# EAGLE design Omnibot_battery_module (EAGLE 9.4.2)
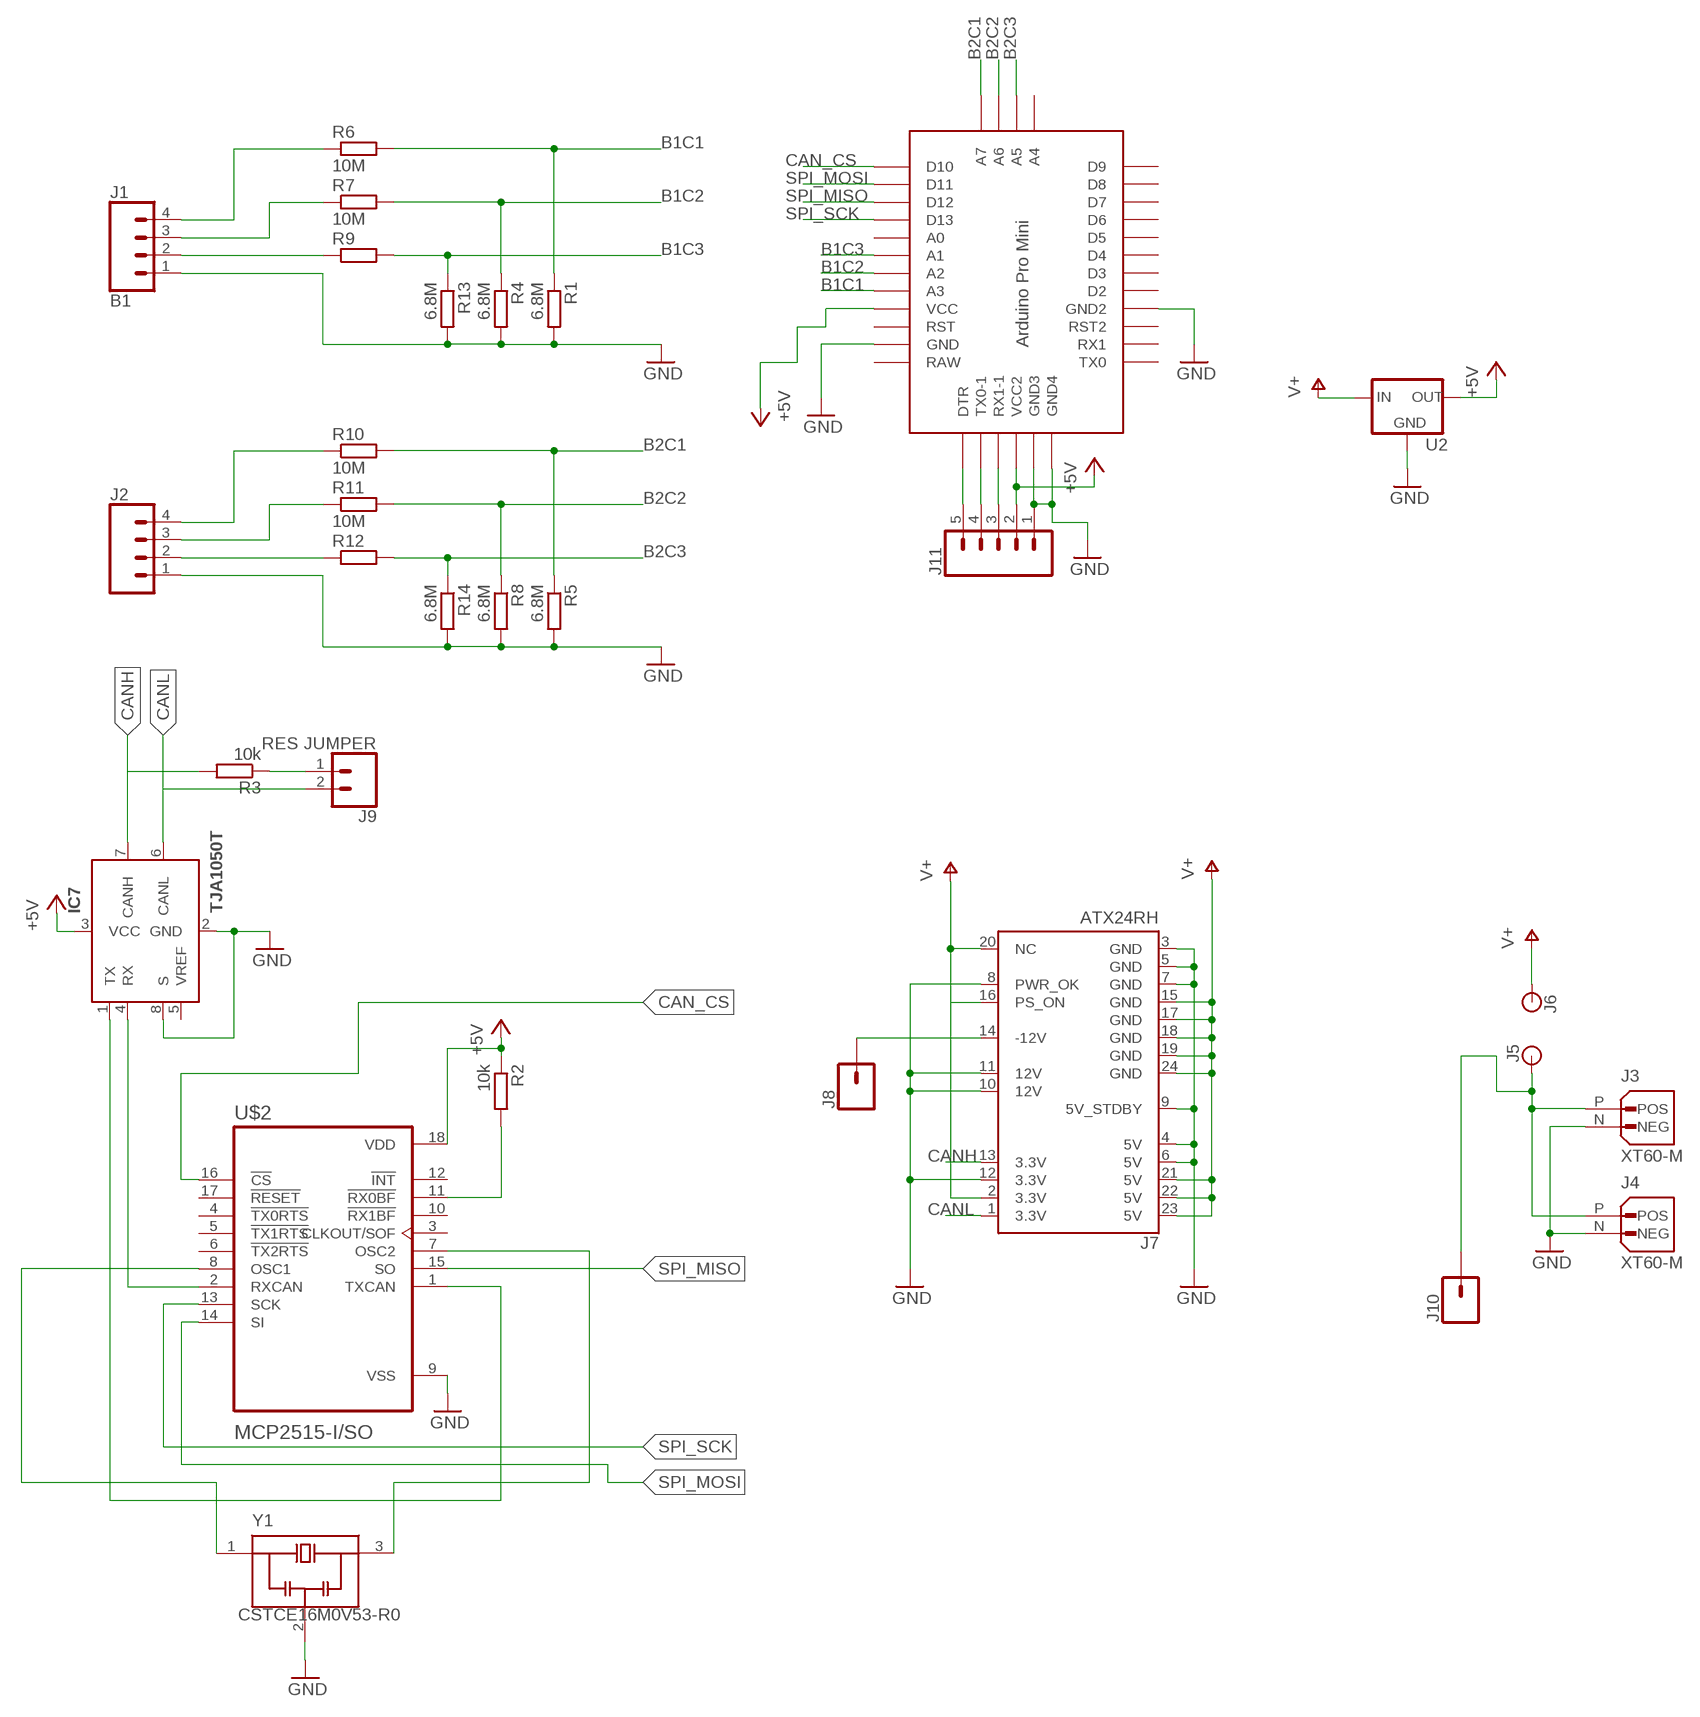
[diagram p0: schematic, sheet 1]

## Parts
IC7  TJA1050T  [SOIC8]
J1  B1  CONN_04POLAR  [MOLEX-1X4]
J2  CONN_04POLAR  [MOLEX-1X4]
J3  XT60-M  [AMASS_XT60-M]
J4  XT60-M  [AMASS_XT60-M]
J5  BANANA_CONN  [BANANA_CONN]
J6  BANANA_CONN  [BANANA_CONN]
J7  ATX24RH  [ATX24_RIGHT_ANGLE]
J8  CONN_01  [1X01]
J9  RES JUMPER  CONN_02  [1X02]
J10  CONN_01  [1X01]
J11  CONN_05PTH  [1X05]
R1  6.8M  R-EU_M0805  [M0805]
R2  10k  R-EU_R0805  [R0805]
R3  10k  R-EU_R0805  [R0805]
R4  6.8M  R-EU_M0805  [M0805]
R5  6.8M  R-EU_M0805  [M0805]
R6  10M  R-EU_M0805  [M0805]
R7  10M  R-EU_M0805  [M0805]
R8  6.8M  R-EU_M0805  [M0805]
R9  10M  R-EU_M0805  [M0805]
R10  10M  R-EU_M0805  [M0805]
R11  10M  R-EU_M0805  [M0805]
R12  10M  R-EU_M0805  [M0805]
R13  6.8M  R-EU_M0805  [M0805]
R14  6.8M  R-EU_M0805  [M0805]
U2  V_REG_78XX-TO-220  [TO-220-ALT]
U$1  PRO-MINI  [PRO-MINI]
U$2  MCP2515-I/SO  [SOIC127P1030X265-18N]
Y1  CSTCE16M0V53-R0  [OSC_CSTCE16M0V53-R0]

## Nets
+5V: IC7.3(VCC) J11.2 R2.1 U2.OUT U$1.VCC U$1.VCC1(VCC2) U$2.18(VDD)
B1C1: R1.1 R6.2 U$1.A3
B1C2: R4.1 R7.2 U$1.A2
B1C3: R9.2 R13.1 U$1.A1
B2C1: R5.1 R10.2 U$1.A7
B2C2: R8.1 R11.2 U$1.A6
B2C3: R12.2 R14.1 U$1.A5
CAN_CS: U$1.D10 U$2.16(!CS)
CANH: IC7.7(CANH) J7.13(3.3V) R3.2
CANL: IC7.6(CANL) J7.1(3.3V) J9.2
GND: IC7.2(GND) IC7.8(S) J1.1 J2.1 J3.N(NEG) J4.N(NEG) J7.3(GND) J7.4(5V) J7.5(GND) J7.6(5V) J7.7(GND) J7.8(PWR_OK) J7.9(5V_STDBY) J7.10(12V) J7.11(12V) J7.12(3.3V) J11.1 R1.2 R4.2 R5.2 R8.2 R13.2 R14.2 U2.GND U$1.GND U$1.GND1(GND2) U$1.GND2(GND4) U$1.GND3 U$2.9(VSS) Y1.2(GND)
N$1: J7.14(-12V) J8.1
N$3: U$2.8(OSC1) Y1.1(IN)
N$4: J3.P(POS) J4.P(POS) J5.P$1 J10.1
N$5: IC7.4(RX) U$2.2(RXCAN)
N$6: R2.2 U$2.11(!RX0BF)
N$7: IC7.1(TX) U$2.1(TXCAN)
N$9: U$2.7(OSC2) Y1.3(OUT)
N$11: J1.4 R6.1
N$12: J9.1 R3.1
N$13: J1.3 R7.1
N$17: J1.2 R9.1
N$19: J2.4 R10.1
N$20: J2.3 R11.1
N$22: J2.2 R12.1
N$24: J11.3 U$1.RX1-1
N$25: J11.4 U$1.TX0-1
N$26: J11.5 U$1.DTR
SPI_MISO: U$1.D12 U$2.15(SO)
SPI_MOSI: U$1.D11 U$2.14(SI)
SPI_SCK: U$1.D13 U$2.13(SCK)
V+: J6.P$1 J7.2(3.3V) J7.15(GND) J7.16(PS_ON) J7.17(GND) J7.18(GND) J7.19(GND) J7.20(NC) J7.21(5V) J7.22(5V) J7.23(5V) J7.24(GND) U2.IN
Unconnected: IC7.5(VREF) U$1.A0 U$1.A4 U$1.D2 U$1.D3 U$1.D4 U$1.D5 U$1.D6 U$1.D7 U$1.D8 U$1.D9 U$1.RST U$1.RST1(RST2) U$1.RX1 U$1.TX0 U$2.3(CLKOUT/SOF) U$2.4(!TX0RTS) U$2.5(!TX1RTS) U$2.6(!TX2RTS) U$2.10(!RX1BF) U$2.12(!INT) U$2.17(!RESET)

## Power pins joined to a net without a drawn wire
RAW: U$1.RAW

## Library data of the parts
IC7 = TJA1050:TJA1050; MF: NXP; MPN: TJA1050T
J1 J2 = SparkFun-Connectors:CONN_04: Multi connection point. Often used as Generic Header-pin footprint for 0.1 inch spaced/style header connections On any of the 0.1 inch spaced packages, you can populate with these: Break Away Headers - Straight <https://www.sparkfun.com/products/116> (PRT-00116) Break Away Male Headers - Right Angle <https://www.sparkfun.com/products/553> (PRT-00553) Female Headers <https://www.sparkfun.com/products/115> (PRT-00115) Break Away Headers - Machine Pin <https://www.sparkfun.com/products/117> (PRT-00117) Break Away Female Headers - Swiss Machine Pin <https://www.sparkfun.com/products/743> (PRT-00743) For SCREWTERMINALS and SPRING TERMINALS visit here: Screw Terimnals on SparkFun.com <https://www.sparkfun.com/search/results?term=Screw+Terminals> (5mm/3.5mm/2.54mm spacing) This device is also useful as a general connection point to wire up your design to another part of your project. Our various solder wires solder well into these plated through hole pads. Hook-Up Wire - Assortment (Stranded, 22 AWG) <https://www.sparkfun.com/products/11375> (PRT-11375) Hook-Up Wire - Assortment (Solid Core, 22 AWG) <https://www.sparkfun.com/products/11367> (PRT-11367) View the entire wire category on our website here <https://www.sparkfun.com/categories/141> Special notes: Molex polarized connector foot print use with SKU : PRT-08231 with associated crimp pins and housings. 1MM SMD Version SKU: PRT-10208; PROD_ID: CONN-08186; SF_ID: PRT-08231
J3 J4 = XT60-M:XT60-M: Check availability <https://pricing.snapeda.com/parts/XT60-M/AMASS/view-part?ref=eda>; AVAILABILITY: Not in stock; CHECK_PRICES: https://www.snapeda.com/parts/XT60-M/AMASS/view-part/?ref=eda; DESCRIPTION: Plug; DC supply; XT60; male; PIN: 2; for cable; soldered; 30A; 500V; MF: AMASS; MP: XT60-M; PACKAGE: Package; PRICE: None; SNAPEDA_LINK: https://www.snapeda.com/parts/XT60-M/AMASS/view-part/?ref=snap
J5 J6 = SparkFun-Connectors:BANANA_CONN: Through-hole Banana Jack Basic PTH connection for banana jack plugs SparkFun Products: Multimeter Kit <https://www.sparkfun.com/products/retired/10956> Banana to Alligator Cable <https://www.sparkfun.com/products/retired/509> Banana to Alligator Coax Cable <https://www.sparkfun.com/products/retired/508> Banana to Banana Cable <https://www.sparkfun.com/products/retired/507> Banana to IC Hook Cables <https://www.sparkfun.com/products/retired/506>
J7 = SparkFun-Connectors:ATX24: ATX24 Pin Power Supply Connector - Right Angle PTH Mount This is a good connector for connecting a computer power supply to a PCB. It's massive, but provides many amps of power at 5V and 12V. SparkFun Products: SparkFun Benchtop Power Board Kit <https://www.sparkfun.com/products/12867> SparkFun Power Driver Shield Kit <https://www.sparkfun.com/products/10618>; PROD_ID: CONN-09674; SF_ID: PRT-09498
J8 J10 = SparkFun-Connectors:CONN_01: Single connection point. Often used as Generic Header-pin footprint for 0.1 inch spaced/style header connections On any of the 0.1 inch spaced packages, you can populate with these: Break Away Headers - Straight <https://www.sparkfun.com/products/116> (PRT-00116) Break Away Male Headers - Right Angle <https://www.sparkfun.com/products/553> (PRT-00553) Female Headers <https://www.sparkfun.com/products/115> (PRT-00115) Break Away Headers - Machine Pin <https://www.sparkfun.com/products/117> (PRT-00117) Break Away Female Headers - Swiss Machine Pin <https://www.sparkfun.com/products/743> (PRT-00743) This device is also useful as a general connection point to wire up your design to another part of your project. Our various solder wires solder well into these plated through hole pads. Hook-Up Wire - Assortment (Stranded, 22 AWG) <https://www.sparkfun.com/products/11375> (PRT-11375) Hook-Up Wire - Assortment (Solid Core, 22 AWG) <https://www.sparkfun.com/products/11367> (PRT-11367) View the entire wire category on our website here <https://www.sparkfun.com/categories/141> Special notes: SMTSO-256-ET is a "flush mount" nut for a 4-40 screw. We mostly use this on specialty testbeds; it is a nice way to connect hardware to your PCB at an adjustable hieght. Also note, the SNAP packages are for using a snappable style connector. We sell a baggie of snaps and they are also used on two LilyPad designs: Snap Assortment - 30 pack (male and female) <https://www.sparkfun.com/products/11347> (DEV-11347) LilyPad Arduino SimpleSnap <https://www.sparkfun.com/products/10941> (DEV-10941) LilyPad SimpleSnap Protoboard <https://www.sparkfun.com/products/10940> (DEV-10940)
J9 = SparkFun-Connectors:CONN_02: Multi connection point. Often used as Generic Header-pin footprint for 0.1 inch spaced/style header connections On any of the 0.1 inch spaced packages, you can populate with these: Break Away Headers - Straight <https://www.sparkfun.com/products/116> (PRT-00116) Break Away Male Headers - Right Angle <https://www.sparkfun.com/products/553> (PRT-00553) Female Headers <https://www.sparkfun.com/products/115> (PRT-00115) Break Away Headers - Machine Pin <https://www.sparkfun.com/products/117> (PRT-00117) Break Away Female Headers - Swiss Machine Pin <https://www.sparkfun.com/products/743> (PRT-00743) For SCREWTERMINALS and SPRING TERMINALS visit here: Screw Terimnals on SparkFun.com <https://www.sparkfun.com/search/results?term=Screw+Terminals> (5mm/3.5mm/2.54mm spacing) This device is also useful as a general connection point to wire up your design to another part of your project. Our various solder wires solder well into these plated through hole pads. Hook-Up Wire - Assortment (Stranded, 22 AWG) <https://www.sparkfun.com/products/11375> (PRT-11375) Hook-Up Wire - Assortment (Solid Core, 22 AWG) <https://www.sparkfun.com/products/11367> (PRT-11367) View the entire wire category on our website here <https://www.sparkfun.com/categories/141> Special notes: Molex polarized connector foot print use with: PRT-08233 with associated crimp pins and housings. 2.54_SCREWTERM for use with PRT-10571. 3.5mm Screw Terminal footprints for PRT-08084 5mm Screw Terminal footprints for use with PRT-08432
J11 = SparkFun-Connectors:CONN_05: Multi connection point. Often used as Generic Header-pin footprint for 0.1 inch spaced/style header connections On any of the 0.1 inch spaced packages, you can populate with these: Break Away Headers - Straight <https://www.sparkfun.com/products/116> (PRT-00116) Break Away Male Headers - Right Angle <https://www.sparkfun.com/products/553> (PRT-00553) Female Headers <https://www.sparkfun.com/products/115> (PRT-00115) Break Away Headers - Machine Pin <https://www.sparkfun.com/products/117> (PRT-00117) Break Away Female Headers - Swiss Machine Pin <https://www.sparkfun.com/products/743> (PRT-00743) For SCREWTERMINALS and SPRING TERMINALS visit here: Screw Terimnals on SparkFun.com <https://www.sparkfun.com/search/results?term=Screw+Terminals> (5mm/3.5mm/2.54mm spacing) This device is also useful as a general connection point to wire up your design to another part of your project. Our various solder wires solder well into these plated through hole pads. Hook-Up Wire - Assortment (Stranded, 22 AWG) <https://www.sparkfun.com/products/11375> (PRT-11375) Hook-Up Wire - Assortment (Solid Core, 22 AWG) <https://www.sparkfun.com/products/11367> (PRT-11367) View the entire wire category on our website here <https://www.sparkfun.com/categories/141> Special notes: Molex polarized connector foot print use with SKU : PRT-08231 with associated crimp pins and housings. 1MM SMD Version SKU: PRT-10208
R1-R14 = resistor:R-EU_: RESISTOR, European symbol
U2 = SparkFun-IC-Power:V_REG_78XX: Voltage Regulator Standard 78xx regulator. IGO (Input Ground Output). Spark Fun Electronics SKU : COM-00107; PROD_ID: VREG-08450; SF_ID: COM-00107
U$1 = Arduino-clone:PRO-MINI: Arduion Pro Mini Clone V1.0 www.betemcu.cu
U$2 = MCP2515-I_SO:MCP2515-I/SO: Check availability <https://pricing.snapeda.com/parts/MCP2515-I/SO/Microchip/view-part?ref=eda>; AVAILABILITY: In Stock; CHECK_PRICES: https://www.snapeda.com/parts/MCP2515-I/SO/Microchip/view-part/?ref=eda; DESCRIPTION: Microchip CAN Controller 1Mbit/s CAN 2.0B 18-Pin SOIC W | Microchip Technology Inc. MCP2515-I/SO; MF: Microchip; MP: MCP2515-I/SO; PACKAGE: SOIC-18 Microchip; PRICE: None; PURCHASE-URL: https://www.snapeda.com/api/url_track_click_mouser/?unipart_id=39881&manufacturer=Microchip&part_name=MCP2515-I/SO&search_term=None; SNAPEDA_LINK: https://www.snapeda.com/parts/MCP2515-I/SO/Microchip/view-part/?ref=snap
Y1 = CSTCE16M0V53-R0:CSTCE16M0V53-R0: Check availability <https://pricing.snapeda.com/parts/CSTCE16M0V53-R0/Murata/view-part?ref=eda>; AVAILABILITY: In Stock; CHECK_PRICES: https://www.snapeda.com/parts/CSTCE16M0V53-R0/Murata+Electronics+North+America/view-part/?ref=eda; DESCRIPTION: 16 MHz Ceramic Resonator Built in Capacitor 15 pF ±0.3% -20°C ~ 80°C Surface Mount; MF: Murata; MP: CSTCE16M0V53-R0; PACKAGE: SMD-3 Murata; PRICE: None; SNAPEDA_LINK: https://www.snapeda.com/parts/CSTCE16M0V53-R0/Murata+Electronics+North+America/view-part/?ref=snap

## Net classes
0 default: width 0.5 mm, drill 1.2 mm, clearance 0.2 mm

## Board
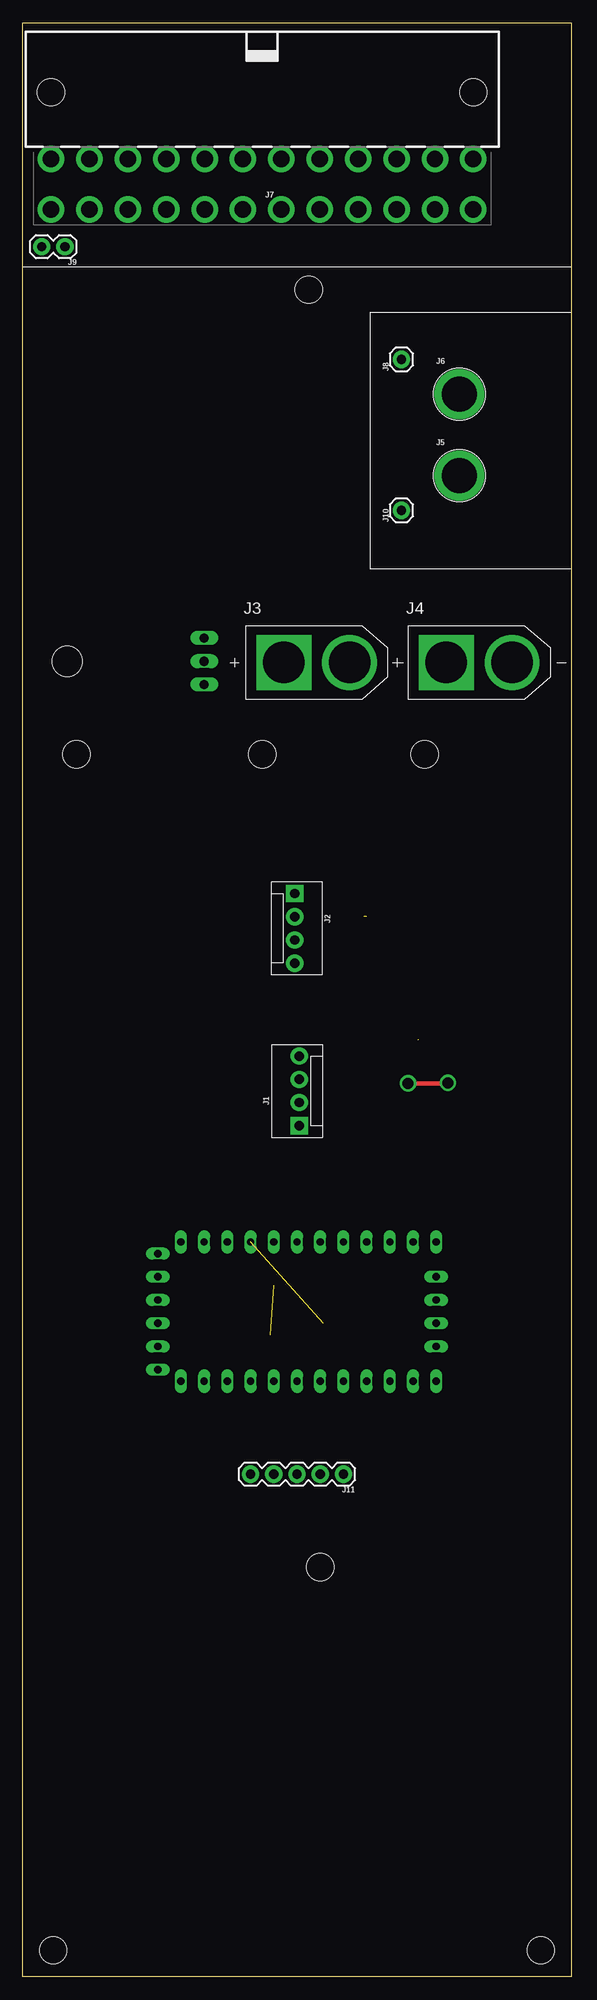
[diagram p1: board, top side]
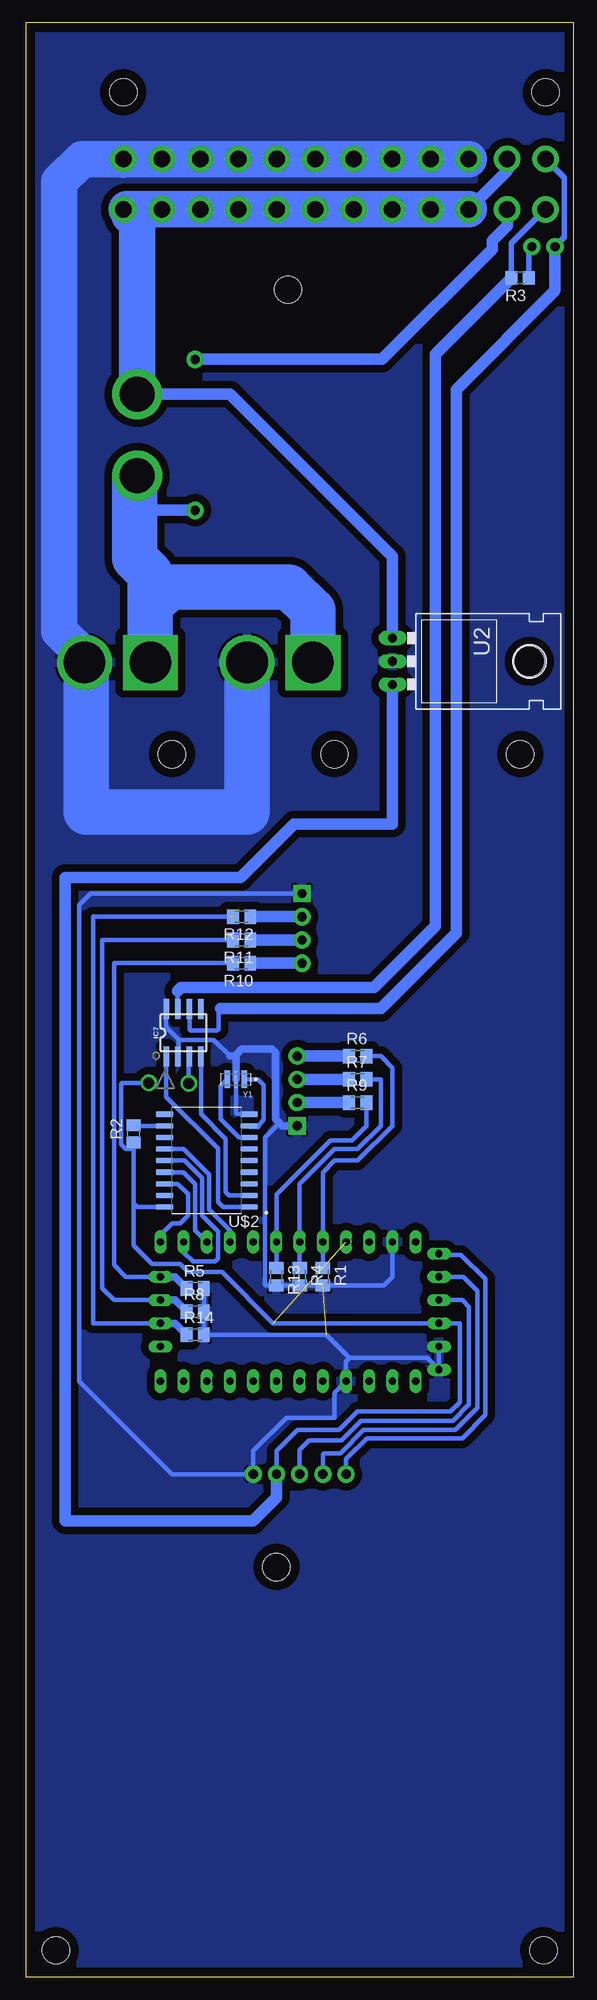
[diagram p2: board, bottom side, seen from below]

Size 60 x 213.67 mm. Coordinates in mm from the lower left corner, seen from the top.
Outline: 60,213.67 60,0 0,0 0,213.67 60,213.67
Copper layers (1*16): Top 0.035mm / dielectric 1.5mm / Bottom 0.035mm
Design rules "default": minimum track width 6mil, minimum drill 0.35mm, track to track 6mil, track to pad 6mil, pad to pad 6mil, via to via 6mil, smd to smd 6mil, copper to edge 40mil, drill to drill 6mil, minimum pad ring 10mil, minimum via ring 8mil, stop-mask expansion 4mil, vias tented up to drill 0mil, thermal gap 10mil
Holes 3 mm at 43.97,133.69 26.19,133.69 5.87,133.69 3.33,2.88 56.67,2.88 32.54,44.79 31.27,184.49

### Footprints (pad centres in the part's own frame; a part is rotated, then mirrored left to right if it is on the bottom)
SOIC8 = smd 2.2 x 0.6: 1 -2.6,1.905; 2 -2.6,0.635; 3 -2.6,-0.635; 4 -2.6,-1.905; 5 2.6,-1.905; 6 2.6,-0.635; 7 2.6,0.635; 8 2.6,1.905
MOLEX-1X4 = drill 1.016 pad 1.88 square: 1 0,0 | drill 1.016 pad 1.88: 2 2.54,0; 3 5.08,0; 4 7.62,0
AMASS_XT60-M = drill 4.55 pad 6: N 3.6,0 | drill 4.55 pad 6 square: P -3.6,0
BANANA_CONN = drill 3.81 pad 5.461: P$1 0,0
ATX24_RIGHT_ANGLE = drill 1.8 pad 2.9: 1 23.1,4.76; 2 18.9,4.76; 3 14.7,4.76; 4 10.5,4.76; 5 6.3,4.76; 6 2.1,4.76; 7 -2.1,4.76; 8 -6.3,4.76; 9 -10.5,4.76; 10 -14.7,4.76; 11 -18.9,4.76; 12 -23.1,4.76; 13 23.1,10.26; 14 18.9,10.26; 15 14.7,10.26; 16 10.5,10.26; 17 6.3,10.26; 18 2.1,10.26; 19 -2.1,10.26; 20 -6.3,10.26; 21 -10.5,10.26; 22 -14.7,10.26; 23 -18.9,10.26; 24 -23.1,10.26 | hole 3: -23.1,-2.54; 23.1,-2.54
1X01 = drill 1.016 pad 1.88: 1 0,0
1X02 = drill 1.016 pad 1.88: 1 0,0; 2 2.54,0
1X05 = drill 1.016 pad 1.88: 1 0,0; 2 2.54,0; 3 5.08,0; 4 7.62,0; 5 10.16,0
M0805 = smd 1.3 x 1.6: 1 -0.95,0; 2 0.95,0
R0805 = smd 1.3 x 1.5: 1 -0.95,0; 2 0.95,0
TO-220-ALT = drill 1.016 long: GND 0,-3.81; IN -2.54,-3.81; OUT 2.54,-3.81 | hole 3.302: 0,11.176
PRO-MINI = drill 0.8 long: A0 8.89,8.89; A1 8.89,11.43; A2 8.89,13.97; A3 8.89,16.51; A4 -2.54,-1.27; A5 0,-1.27; A6 2.54,-1.27; A7 5.08,-1.27; D2 -6.35,16.51; D3 -6.35,13.97; D4 -6.35,11.43; D5 -6.35,8.89; D6 -6.35,6.35; D7 -6.35,3.81; D8 -6.35,1.27; D9 -6.35,-1.27; D10 8.89,-1.27; D11 8.89,1.27; D12 8.89,3.81; D13 8.89,6.35; DTR 7.62,29.21; GND 8.89,24.13; GND1 -6.35,19.05; GND2 -5.08,29.21; GND3 -2.54,29.21; RAW 8.89,26.67; RST 8.89,21.59; RST1 -6.35,21.59; RX1 -6.35,24.13; RX1-1 2.54,29.21; TX0 -6.35,26.67; TX0-1 5.08,29.21; VCC 8.89,19.05; VCC1 0,29.21
SOIC127P1030X265-18N = smd 1.91 x 0.6: 1 -4.61,5.08; 2 -4.61,3.81; 3 -4.61,2.54; 4 -4.61,1.27; 5 -4.61,0; 6 -4.61,-1.27; 7 -4.61,-2.54; 8 -4.61,-3.81; 9 -4.61,-5.08; 10 4.61,-5.08; 11 4.61,-3.81; 12 4.61,-2.54; 13 4.61,-1.27; 14 4.61,0; 15 4.61,1.27; 16 4.61,2.54; 17 4.61,3.81; 18 4.61,5.08
OSC_CSTCE16M0V53-R0 = smd 0.6 x 1.9: 1 -0.95,0; 3 0.95,0 | smd 0.4 x 1.9: 2 0,0

### Placement (x,y rotation side)
IC7  42.7,103.21 90 bottom
J1  30.25,93.05 90 top
J2  29.75,118.45 270 top
J3  32.16,143.72 0 top
J4  49.94,143.72 0 top
J5  47.78,164.17 0 top
J6  47.78,173.06 0 top
J7  26.19,203.54 180 top
J8  41.43,176.87 90 top
J9  4.6,189.19 180 top
J10  41.43,160.36 90 top
J11  35.08,54.95 180 top
R1  27.46,76.54 270 bottom
R2  48.16,92.16 90 bottom
R3  5.87,185.76 180 bottom
R4  30,76.54 270 bottom
R5  41.43,75.27 0 bottom
R6  23.65,100.67 0 bottom
R7  23.65,98.13 0 bottom
R8  41.43,72.73 0 bottom
R9  23.65,95.59 0 bottom
R10  36.35,110.83 180 bottom
R11  36.35,113.37 180 bottom
R12  36.35,115.91 180 bottom
R13  32.54,76.54 270 bottom
R14  41.43,70.19 0 bottom
U2  16.03,143.85 270 bottom
U$1  43.97,71.46 90 top
U$2  40.16,89.24 180 bottom
Y1  36.98,98.13 180 bottom

### Tracks (layer width: path | path; a pad name or v marks a point on that pad's centre or on a via)
+5V  (via drill 1.2)  (1 unrouted)
  Top 0.5: v46.51,97.75 46.46,97.7 v42.14,97.7
  Bottom 0.5: R2.1 48.16,90.51 | 48.16,90.51 48.16,84.54 47.78,84.16 U$2.18 | IC7.3 42.14,100.53 v42.14,97.7 | v46.51,97.75 49.43,97.75 49.56,97.62 49.56,91.02 49.05,90.51 48.16,90.51 | J11.2 32.54,57.49 30.25,59.78 25.68,59.78 23.65,61.81 13.49,61.81 12.47,62.82 12.47,71.46 U$1.VCC1
  Bottom 0.508: 48.16,84.54 48.16,79.97 46.13,77.94 43.08,77.94 42.19,77.05 38.51,77.05 32.92,71.46 U$1.VCC1
  Bottom 1.27: J11.2 32.54,52.41 35.08,49.87 55.65,49.87 55.65,120.19 36.49,120.19 30.62,126.07 19.84,126.07 U2.OUT
B1C1
  Bottom 0.5: R6.2 21.11,100.67 | 19.84,99.27 19.84,93.05 | 27.46,84.16 U$1.A3 R1.1
  Bottom 0.508: 19.84,93.05 23.65,89.24 26.19,89.24 27.46,87.97 27.46,84.16 | 21.11,100.67 19.84,99.4 19.84,99.27
B1C2
  Bottom 0.5: R7.2 21.11,98.13 21.11,93.05 | 30,80.6 U$1.A2 R4.1
  Bottom 0.508: 30,80.6 30,86.7 26.19,90.51 23.65,90.51 21.11,93.05
B1C3
  Bottom 0.5: R9.2 22.7,93.05 | 32.54,81.62 U$1.A1 R13.1
  Bottom 0.508: 22.7,93.05 24.29,91.46 26.19,91.46 26.64,91.46 32.54,85.56 U$1.A1
B2C1
  Bottom 0.5: R10.2 50.32,110.83 50.32,81.62
  Bottom 0.508: 50.32,81.62 50.32,77.81 49.05,76.54 U$1.A7
  Bottom 0.813: R5.1 43.65,76.54 U$1.A7
B2C2
  Bottom 0.5: 51.59,80.35 51.59,113.37 R11.2
  Bottom 0.508: U$1.A6 50.32,74 51.59,75.27 51.59,80.35
  Bottom 0.813: R8.1 43.65,74 U$1.A6
B2C3  (1 unrouted)
  Bottom 0.5: U$1.A5 52.61,71.46 52.61,115.91 37.62,115.91
  Bottom 0.813: R14.1 43.65,71.46 U$1.A5
CAN_CS
  Bottom 0.5: U$2.16 43.34,86.7 42.23,85.59 42.23,83.23 43.08,82.38 43.97,82.38 45.24,81.11 U$1.D10
CANH
  Bottom 0.5: IC7.7 43.34,107.78
  Bottom 0.61: R3.2 6.82,189.57 3.11,193.28 J7.13
  Bottom 1.27: R3.2 15.14,177.44 15.14,114.89 21.87,108.16 42.7,108.16 | 42.7,108.16 42.95,108.16 43.34,107.78 | 42.7,108.16
CANL
  Bottom 0.508: 38.64,105.88 38.89,105.62 38.89,103.59 39.02,103.46 41.94,103.46 42.06,103.59 IC7.6
  Bottom 0.61: J7.1 1.04,196.73 1.04,190.2 J9.2
  Bottom 1.27: J9.2 2.06,184.36 12.85,173.57 12.85,114.13 21.11,105.88 38.64,105.88
GND  (2 unrouted)
  Bottom 0.5: R1.2 R4.2 R13.2 | 37.62,100.67 39.4,102.45 43.27,102.45 43.27,100.67 IC7.2 | IC7.8 44.6,103.84 43.27,102.51 | J11.1 35.08,57.49 31.46,61.11 26.19,61.11 26.19,63.84 U$1.GND1 24.92,67.27 24.54,67.65 16.03,67.65 U$1.GND2 U$1.GND3 | R5.2 R8.2 R14.2 | U$2.9 36.86,94.32 36.98,94.45 Y1.2
  Bottom 0.508: U$1.GND 19.84,76.54 20.79,75.59 R1.2 | R14.2 27.08,70.19 24.54,67.65 | 32.22,93.37 33.81,91.78 33.81,75.65 33.75,75.59 R13.2 | J2.1 52.86,118.45 54.13,117.18 54.13,65.11 43.97,54.95 J11.1
  Bottom 0.813: J1.1 31.91,93.05 32.22,93.37 32.67,93.81 32.67,101.05 33.05,101.43 36.35,101.43 36.98,100.8 36.98,100.67 | 36.98,100.67 Y1.2 | 36.98,100.67 37.62,100.67
  Bottom 2.54: J7.3 J7.4 J7.5 J7.6 J7.7 32.22,198.78 32.54,198.46 | J7.8 J7.9 J7.10 J7.11 48.73,198.78 49.05,198.46 49.29,198.7 J7.12
  Bottom 4: J7.3 49.21,198.78 49.29,198.7 | J7.12 53.81,198.78 56.29,196.3 56.29,147.15 53.37,144.23
  Bottom 5: J3.N 35.76,127.34 53.37,127.34 53.37,144.23
  pour Bottom (isolate 0.813): -4.29,213.7 -4.29,-4.74 -1.75,-4.74 63.02,-4.74 63.02,-0.93 63.02,216.24 -3.02,216.24 -4.29,216.24
N$1
  Bottom 1.27: J7.14 7.29,191.5 8.92,189.87 8.92,188.94 20.98,176.87 J8.1
N$3
  Bottom 0.5: 34.52,92.92 35.42,92.92 U$2.8 34.57,93.05 33.94,93.69 33.94,97.5 34.57,98.13 Y1.1
N$4
  Bottom 1.27: J10.1 48.03,160.36
  Bottom 5: J3.P 28.56,149.39 31.14,151.98 44.22,151.98 46.34,149.86 | J4.P 46.34,149.86 | 46.34,149.86 46.34,153.46 48.03,155.15 48.03,160.36 48.03,163.92 J5.P$1
N$5
  Bottom 0.5: U$2.2 37.71,85.43 38.09,85.81 38.09,91.62 40.8,94.32 IC7.4
N$6
  Bottom 0.5: R2.2 48.1,93.05 U$2.11
N$7
  Bottom 0.5: U$2.1 38.38,84.16 38.95,84.73 38.95,90.57 44.6,96.22 IC7.1
N$9
  Bottom 0.5: Y1.3 38.64,97.43 38.64,93.81 36.6,91.78 U$2.7
N$11
  Bottom 1.27: R6.1 J1.4
N$12
  Bottom 0.61: J9.1 4.92,188.87 R3.1
N$13
  Bottom 1.27: J1.3 R7.1
N$17
  Bottom 1.27: R9.1 J1.2
N$19
  Bottom 1.27: J2.4 R10.1
N$20
  Bottom 1.27: R11.1 J2.3
N$22
  Bottom 1.27: J2.2 R12.1
N$24
  Bottom 0.5: J11.3 30,57.62 28.98,58.63 25.43,58.63 23.27,60.79 13.24,60.79 11.46,62.57 11.46,73.24 12.22,74 U$1.RX1-1
N$25
  Bottom 0.5: 13.49,76.54 U$1.TX0-1 12.09,76.54 10.57,75.02 10.57,62.19 12.98,59.78 23.02,59.78 25.55,57.24 27.33,57.24 27.46,57.11 J11.4
N$26
  Bottom 0.5: U$1.DTR 14.63,78.95 12.35,78.95 9.68,76.29 9.68,61.43 12.22,58.89 22.63,58.89 24.92,56.6 J11.5
SPI_MISO
  Bottom 0.5: U$1.D12 41.43,81.62 41.43,86.7 42.7,87.97 U$2.15
SPI_MOSI
  Bottom 0.5: U$1.D11 42.7,79.21 41.68,78.19 39.27,78.19 38.93,78.53 38.93,81.49 40.67,83.23 40.67,87.34 42.57,89.24 U$2.14
SPI_SCK
  Bottom 0.5: U$2.13 44.75,90.49 42.68,90.49 39.91,87.72 39.91,83.91 37.62,81.62 U$1.D13
V+
  Bottom 1.27: U2.IN 19.84,155.28 37.62,173.06 J6.P$1 | J7.15 7.29,197.48 J7.2
  Bottom 2.54: J7.17 19.99,193.38 24.92,193.38 24.82,193.28 J7.18 J7.19 28.39,193.38 33.81,193.38 33.71,193.28 J7.20 J7.21 J7.22 J7.23 | 48.95,193.28 49.05,193.38 49.19,193.38 J7.24 48.59,192.58
  Bottom 4: 48.59,192.58 47.78,191.77 | 47.78,191.77 J6.P$1 | 47.78,191.77 47.78,192.11 48.95,193.28 J7.23 J7.17 J7.16 J7.15